# Altium schematic sheet Controller_Schematic.SchDoc
size A4; SheetNumber: 1; SheetTotal: 1
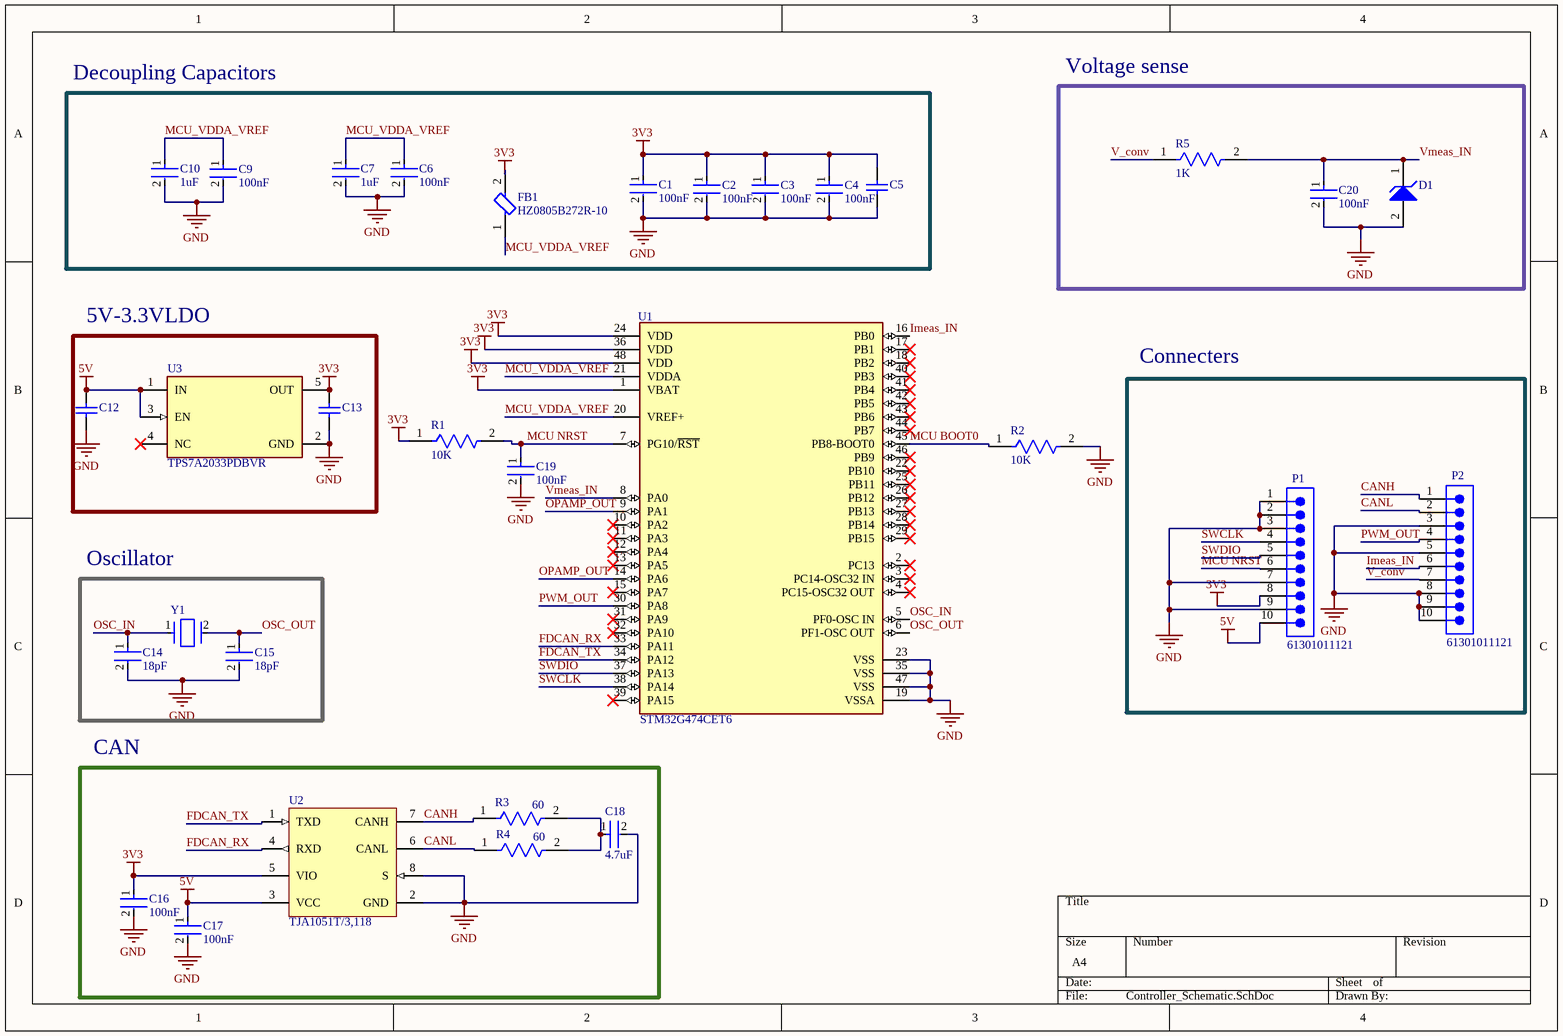
[diagram p0: Controller_Schematic.SchDoc]

## Parts
C1  100nF  [FP-GCM21B-0_15-MFG]
C2  100nF  [FP-GCM21B-0_15-MFG]
C3  100nF  [FP-GCM21B-0_15-MFG]
C4  100nF  [FP-GCM21B-0_15-MFG]
C5  GRM21BR61A475KA73L  [CAPC2013X140X45NL15T25]  (value not drawn)
C6  100nF  [FP-GCM21B-0_15-MFG]
C7  1uF  [FP-GCM21B-0_15-MFG]
C9  100nF  [FP-GCM21B-0_15-MFG]
C10  1uF  [FP-GCM21B-0_15-MFG]
C12  GRM21BR61A106KE19L  [MURA-0805_H_1.35_M]  (value not drawn)
C13  GRM21BR61A106KE19L  [MURA-0805_H_1.35_M]  (value not drawn)
C14  18pF  [FP-GRM21A-0_2-IPC_B]
C15  18pF  [FP-GRM21A-0_2-IPC_B]
C16  100nF  [FP-GCM21B-0_15-MFG]
C17  100nF  [FP-GCM21B-0_15-MFG]
C18  4.7uF  [FP-GCM21B-0_2-e0_3_0_75-IPC_C]
C19  100nF  [FP-GCM21B-0_15-MFG]
C20  100nF  [FP-GCM21B-0_15-MFG]
D1  MMSZ5226CT1G  [ONSC-SOD-123-2-425-04_V]  (value not drawn)
FB1  HZ0805B272R-10  [FP-HZ0805B272R-10-MFG]
P1  61301011121  [61301011121]
P2  61301011121  [61301011121]
R1  10K  [FP-SR0805-MFG]
R2  10K  [FP-SR0805-MFG]
R3  60  [FP-AC0805-MFG]
R4  60  [FP-AC0805-MFG]
R5  1K  [FP-AT0805-IPC_B]
U1  STM32G474CET6  [FP-STM32G474CET6-MFG]
U2  TJA1051T/3,118  [NXP-SOIC-8_L]
U3  TPS7A2033PDBVR  [FP-DBV0005A-MFG]
Y1  ABM3-24.000MHZ-B2-T  [FP-ABM3-MFG]  (value not drawn)

## Blocks framed on the sheet
Voltage sense: C20 D1 R5
Decoupling Capacitors: C1-C7 C9 C10 FB1
5V-3.3VLDO: C12 C13 U3
Connecters: P1 P2
Oscillator: C14 C15 Y1
CAN: C16-C18 R3 R4 U2

## Nets
3V3: C1.1 C2.1 C3.1 C4.1 C5.2 C13.2 C16.1 FB1.2 P1.8 R1.1 U1.1(VBAT) U1.24(VDD) U1.36(VDD) U1.48(VDD) U2.5(VIO) U3.5(OUT)
5V: C12.2 C17.1 P1.10 U2.3(VCC) U3.1(IN) U3.3(EN)
GND: C1.2 C2.2 C3.2 C4.2 C5.1 C6.2 C7.2 C9.2 C10.2 C12.1 C13.1 C14.2 C15.2 C16.2 C17.2 C18.2 C19.2 C20.2 D1.2(A) P1.1 P1.2 P1.3 P1.7 P1.9 P2.3 P2.5 P2.8 P2.9 P2.10 R2.2 U1.19(VSSA) U1.23(VSS) U1.35(VSS) U1.47(VSS) U2.2(GND) U2.8(S) U3.2(GND)
CANH: P2.1 R3.1 U2.7(CANH)
CANL: P2.2 R4.1 U2.6(CANL)
FDCAN_RX: U1.33(PA11) U2.4(RXD)
FDCAN_TX: U1.34(PA12) U2.1(TXD)
Imeas_IN: P2.6 U1.16(PB0)
MCU BOOT0: R2.1 U1.45(PB8-BOOT0)
MCU NRST: C19.1 P1.6 R1.2 U1.7(PG10/~{RST})
MCU_VDDA_VREF: C6.1 C7.1 C9.1 C10.1 FB1.1 U1.20(VREF+) U1.21(VDDA)
OPAMP_OUT: U1.9(PA1) U1.14(PA6)
OSC_IN: C14.1 U1.5(PF0-OSC_IN) Y1.1
OSC_OUT: C15.1 U1.6(PF1-OSC_OUT) Y1.2
PWM_OUT: P2.4 U1.30(PA8)
SWCLK: P1.4 U1.38(PA14)
SWDIO: P1.5 U1.37(PA13)
V_conv: P2.7 R5.1
Vmeas_IN: C20.1 D1.1(K) R5.2 U1.8(PA0)
NetC18_1: C18.1 R3.2 R4.2

Not connected (* = marked no-connect by the designer): U1 2(PC13)* 3(PC14-OSC32_IN)* 4(PC15-OSC32_OUT)* 10(PA2)* 11(PA3)* 12(PA4)* 13(PA5)* 15(PA7)* 17(PB1)* 18(PB2)* 22(PB10)* 25(PB11)* 26(PB12)* 27(PB13)* 28(PB14)* 29(PB15)* 31(PA9)* 32(PA10)* 39(PA15)* 40(PB3)* 41(PB4)* 42(PB5)* 43(PB6)* 44(PB7)* 46(PB9)*; U3 4(NC)*

## Library data of the parts
C1-C4 C6 C9 C16 C17 C19 C20 = CMP-2007-03364-2: Ceramic Capacitor for Automotive 100nF ±10% 100VDC X7R 0805 Embossed T/R; Voltage Rating: 100V; Termination: SMD/SMT; Tolerance: 10%; Case Code (Imperial): 0805; Length: 2mm; Max Operating Temperature: 125°C; Case/Package: 0805; Mount: Surface Mount; Packaging: Tape and Reel; Package Quantity: 1; Min Operating Temperature: -55°C; Case Code (Metric): 2012; Radiation Hardening: No; REACH SVHC: No SVHC; Dielectric: X7R; Depth: 1.25mm; Lead Free: Lead Free; Ratings: AEC-Q200; Height: 1.25mm; Voltage: 100V; Capacitance: 100nF; Voltage Rating (DC): 100V; Width: 0.049inch; Thickness: 0.055inch
C5 = CMP-2007-03391-1: Manufacturer: Murata; Part Number: GRM21BR61A475KA73L
C7 C10 = CMP-2007-03346-2: Ceramic Capacitor for Automotive 1uF ±10% 25VDC X7R 0805 Embossed T/R; Voltage Rating (DC): 25V; Dielectric: X7R; Max Operating Temperature: 125°C; Lead Free: Lead Free; Ratings: AEC-Q200; Voltage Rating: 25V; Case Code (Imperial): 0805; Package Quantity: 3000; Termination: SMD/SMT; Packaging: Tape and Reel; Tolerance: 10%; Length: 2mm; Voltage: 25V; Radiation Hardening: No; Depth: 1.25mm; Case/Package: 0805; Thickness: 0.055inch; Width: 0.049inch; Min Operating Temperature: -55°C; Mount: Surface Mount; Capacitance: 1uF; REACH SVHC: No SVHC; Case Code (Metric): 2012; Height: 1.25mm
C12 C13 = CMP-2000-05254-1: CAP, Ceramic, 10 uF, 10%, 10 V, 0805, RoHS, Tape and Reel; Manufacturer: Murata; Voltage - Rated: 10V; Product Training Modules: High-CapMultilayerCeramicCapacitors; Catalog Drawings: GRMSeries_0805_1.25; Temperature Coefficient: X5R; Online Catalog: GRMSeries; Featured Product: GA3SafetyRecognizedCapsandHi-CapMLCC; Capacitance: 10µF; Other Names: 490-1709-6; Applications: GeneralPurpose; Category: Capacitors; Datasheet Version: Aug-14; Datasheet URL: https://datasheet.ciiva.com/3777/210grm21br61a106ke1923-3777175.pdf; Ratings: -; Height - Seated (Max): -; Lead Spacing: -; Operating Temperature: -55degC~85degC; Features: -; Package Description: 2-Pin Surface Mount Device (0805), Body 2.1 x 1.35 mm; Standard Package: 1; Mounting Type: SurfaceMount,MLCC; Package Reference: 805; Tolerance: ±10%; Manufacturer URL: http://www.murata.com/; Size / Dimension: 0.079"Lx0.049"W(2.00mmx1.25mm); Packaging: Digi-Reel; Thickness (Max): 0.053"(1.35mm); Package / Case: 0805(2012Metric); Family: CeramicCapacitors; Series: GRM; Lead Style: -
C14 C15 = CMP-06035-034147-1: Chip Multilayer Ceramic Capacitors for General Purpose, 0805, 18pF, C0G, 30ppm/°C, 5%, 200V; Termination: SMD/SMT; Max Operating Temperature: 125°C; Dielectric Material: Ceramic; Min Operating Temperature: -55°C; Dielectric: C0G; Width: 1.25mm; Case Code (Imperial): 0805; Voltage: 200V; Case Code (Metric): 2012; Height: 1mm; Voltage Rating (DC): 200V; Package Quantity: 4000; Depth: 1.25mm; Thickness: 0.051inch; Capacitance: 18pF; Case/Package: 0805; Temperature Coefficient: 30ppm/°C; Packaging: Tape and Reel; Voltage Rating: 200V; Mount: Surface Mount; Tolerance: 5%; Resistor Type: Ceramic; Weight: 0.000335oz; Length: 2mm
C18 = CMP-06035-011837-1: Ceramic Capacitor for Automotive 4.7nF ±1% 250VDC C0G 0805 Embossed T/R
D1 = CMP-1060-00379-1: Zener Voltage Regulator, 500 mW, 2-Pin SOD-123, Pb-Free, Tape and Reel; Manufacturer: On Semiconductor; VZ Typ (V): 3.3; P Max (W): 0.5; ComponentLink2URL: http://www.onsemi.com/pub_link/Collateral/MMSZ5221BT1-D.PDF; Packing: Tape and Reel; ComponentLink1Description: Manufacturer URL; PackageVersion: Rev. G, 10/2009; PackageDescription: 2-Pin SOD, Body 1.6 x 2.69 mm; ComponentLink3URL: http://www.onsemi.com/pub_link/Collateral/425-04.PDF; RoHS: Pb-Free; ComponentLink1URL: http://www.onsemi.com/; ComponentLink3Description: Package Specification; PartNumber: MMSZ5226CT1G; PackageReference: SOD-123-2-425-04; ComponentLink2Description: Datasheet; DatasheetVersion: Rev. 12; Mounting Technology: Surface Mount
FB1 = CMP-19111-000018-1: FERRITE BEAD 2.7 KOHM 0805 1LN; Number of Lines: 1; Impedance: 2.7kR; Max DC Current: 200mA; Test Frequency: 100MHz; DC Resistance (DCR): 800mR; Shielding: Unshielded; Max Operating Temperature: 125°C; Material: Ferrite; Width: 0.049inch; Weight: 0.00392oz; Packaging: Tape and Reel; Mount: Surface Mount; Case/Package: 0805; Termination: SMD/SMT; Lead Free: Lead Free; Case Code (Imperial): 0805; Case Code (Metric): 2012; Series: HZ; Current Rating: 200mA; RoHS Compliant: No; Package Quantity: 1; Length: 2mm; Depth: 1.25mm; Height: 1.25mm; Min Operating Temperature: -40°C; Max Current Rating: 200mA; Frequency: 100MHz
P1 P2 = CMP-1502-01082-6: THT Vertical Pin Header WR-PHD, Pitch 2.54 mm, Single Row, 10 pins; Gender: Male; Voltage Rating: 250V; Connector Type: Male Pin; Current Rating: 3A; Number of Contacts: 10; Pitch: 2.54mm; Contact Resistance: 20mΩ; Insulation Resistance: 1GΩ; RoHS: Compliant; Length: 2.54mm; Max Operating Temperature: 105°C; Flammability Rating: UL94 V-0; Width: 25.4mm; Number of Positions: 10; Number of Rows: 1; Lead Pitch: 2.54mm; Number of Pins: 10; Termination: Solder; Operating Supply Voltage: 250V; Color: Black; Housing Material: PBT; Orientation: Vertical; Packaging: Bulk; Mount: Through Hole; Contact Mating Length: 5.9944mm; Contact Material: Gold; Height: 8.74mm; Min Operating Temperature: -40°C; Contact Plating: Gold; Contact Gender: Male
R1 R2 = CMP-03412-005404-1: RES SMD 0805 1/2W 1% 10K OHM; Manufacturer Part Number: SR0805FR-4710KL; Manufacturer: Yageo; Value: 10KΩ; Power Rating: 0.5W; Voltage Rating: 150V; Tolerance: 0.01; Automotive Grade: Grade 0; RoHS: TRUE; Package: SR0805; Temperature: -55°C to +155°C; Composition: Thick Film; Lead Free: Yes; Ipc Land Pattern Name: RESC200125X50; Footprint Url: http://www.yageo.com/exep/pages/download/literatures/PYu-R_Mount_10.pdf; ComponentLink2URL: http://www.yageo.com/documents/recent/PYu-SR_D_F%20tol_RoHS_L_3.pdf; Series: SR; Resistance: 10KΩ; Device Class L3: Chip SMD Resistors; Device Class L2: Resistors; Digikey Description: RES SMD 0805 1/2W 1% 10K OHM; Category: Res; Temperature Range Low: -55°C; ComponentLink2Description: Datasheet; Automotive: Yes; Height: 0.6mm; Octopart: https://octopart.com/sr0805fr-4710kl-yageo-91478094; Device Class L1: Passive Components; Temperature Range High: +155°C
R3 R4 = CMP-03412-037705-1: Manufacturer: Yageo; Manufacturer Part Number: AC0805FR-0759RL; Value: 59Ω; Power Rating: 1/8W; Tolerance: 0.01; Automotive Grade: Grade 0; Voltage Rating: 150V; ComponentLink2URL: http://www.yageo.com/documents/recent/PYu-AC_51_RoHS_L_6.pdf; Composition: Thick Film; ComponentLink2Description: Datasheet; Footprint Url: http://www.yageo.com/exep/pages/download/literatures/PYu-R_Mount_10.pdf; Resistance: 59Ω; Temperature Range Low: -55°C; Octopart: https://octopart.com/ac0805fr-0759rl-yageo-91867354; Mouser Description: Res Thick Film 0805 59 Ohm 1% 0.125W(1/8W) ±100ppm/C Epoxy Pad SMD Automotive T/R; Category: Res; Device Class L2: Resistors; Automotive: Yes; Temperature Range High: +155°C; Temperature: -55°C to +155°C; Lead Free: Yes; Device Class L1: Passive Components; RoHS: TRUE; Package: AC0805; Device Class L3: Chip SMD Resistors; Height: 0.6mm; Ipc Land Pattern Name: RESC200125X50; Series: AC
R5 = CMP-03412-043702-1: Thin Film Chip Resistors Automotive Grade 1kΩ 0.5% 50ppm/°C 0805; Resistance: 1kR; Max Power Dissipation: 125mW; Number of Terminations: 2; RoHS Compliant: Yes; Case Code (Imperial): 0805; Case/Package: 0805; Min Operating Temperature: -55°C; Features: Moisture Resistant; Resistor Type: Thin Film; Height: 0.024inch; Width: 0.049inch; Tolerance: 0.5%; Length: 0.079inch; Max Operating Temperature: 155°C; Series: AT; Temperature Coefficient: 50ppm/°C; Packaging: Cut Tape; Case Code (Metric): 2012
U1 = CMP-12105-000053-1: MAINSTREAM ARM CORTEX-M4 CORE WI; Manufacturer: STMicroelectronics; Number Of Usb Channels: 1; Number Of Uart Channels: 4; Number Of Adc Channels: 20; Ram Size: 128KBytes; Standoff Height: 0.05mm; Number Of A/D Converters: 5; Number Of I/Os: 38; Max Supply Voltage: 3.6V; Frequency: 170MHz; Min Supply Voltage: 1.62V; Interface: I2C,SPI,UART,USART,CAN,USB,LIN,IrDA,I2S,SMBus,Other; Memory Size: 512KBytes; Max Junction Temp: +105°C; Number Of Spi Channels: 3; Number Of Pwm Channels: 12; Memory Type: FLASH; Number Of Timers/Counters: 14; Data Bus Width: 32bits; Temperature Range Low: -40°C; RoHS: TRUE; Automotive: No; Octopart: https://octopart.com/stm32g474cet6-stmicroelectronics-99072248; ComponentLink2URL: https://www.st.com/resource/en/datasheet/stm32g474ce.pdf; Ambient Temperature Range Low: -40°C; Temperature Range High: +85°C; Manufacturer Part Number: STM32G474CET6; Ambient Temperature Range High: +85°C; ComponentLink2Description: Datasheet; Device Class L1: Integrated Circuits (ICs); Temperature: -40°C to +85°C; Device Class L3: Microcontrollers; Number Of I2C Channels: 4; Device Class L2: Embedded Processors and Controllers; Category: IC; Mouser Description: Cortex M4 512K LQFP48 85°C; Number Of Cores: 1; Digikey Description: MAINSTREAM ARM CORTEX-M4 CORE WI; Core Architecture: ARM Cortex-M4; Height: 1.6mm; Package: LQFP48; Lead Free: Yes
U2 = CMP-2000-07245-1: High-Speed CAN Transceiver, 3 to 5 V, 8-Pin SOIC (SOT96-1), RoHS, Tape and Reel; Manufacturer: NXP; Power Down Mode: Normal/Silent; Rad Hardened: No; Number of Transceivers: 1; Supply Current: 70mA; Operating Supply Voltage (Max): 5.5V; Operating Supply Voltage (Typ): 5V; Operating Supply Voltage (Min): 4.5V; Standard Supported: ISO11898-2; Data Rate: 1Mbps; DELETED: Compliant; Operating Temperature (Min): -40C; Datasheet Version: Rev. 7, 01/2015; Pin Count: 8; Operating Temperature (Max): 125C; Package Description: 8-Pin Small Outline Integrated Circuit, Body 4.9 x 3.9 mm, Pitch 1.27 mm; Category: Transceiver; Packaging: TapeandReel; Mounting: SurfaceMount; Package Reference: SOT96-1; Operating Temperature Classification: Automotive; Mounting Technology: SurfaceMount; Package Type: SO; Manufacturer URL: http://www.nxp.com/; Datasheet URL: http://www.nxp.com/documents/data_sheet/TJA1051.pdf
U3 = CMP-04917-000300-1: IC REG LINEAR 3.3V 300MA SOT23-5; RoHS Compliant: Yes
Y1 = CMP-27762-013604-1: Crystal 24MHz ±20ppm 18pF SMD-2 5mm x 3.2mm; Series Resistance: 50R; ESR (Equivalent Series Resistance): 30R; Frequency Stability: 50ppm; Max Operating Temperature: 70°C; Resistor Type: Ceramic; Series: ABM3; REACH SVHC: Yes; Min Operating Temperature: -20°C; Lead Free: Lead Free; Number of Pins: 2; Packaging: Tape and Reel; Termination: SMD/SMT; Length: 5mm; Depth: 3.2mm; Package Quantity: 1000; Case/Package: CSMD; Accuracy: 20ppm; Height: 0.051inch; Mount: Surface Mount; Width: 3.2mm; Tolerance: 20ppm; Frequency Tolerance: 20ppm; Load Capacitance: 18pF; Operating Frequency: 24 MHz; Frequency: 24MHz; Radiation Hardening: No